# Altium schematic sheet POE.SchDoc
size A4; SheetNumber: 8; SheetTotal: 14
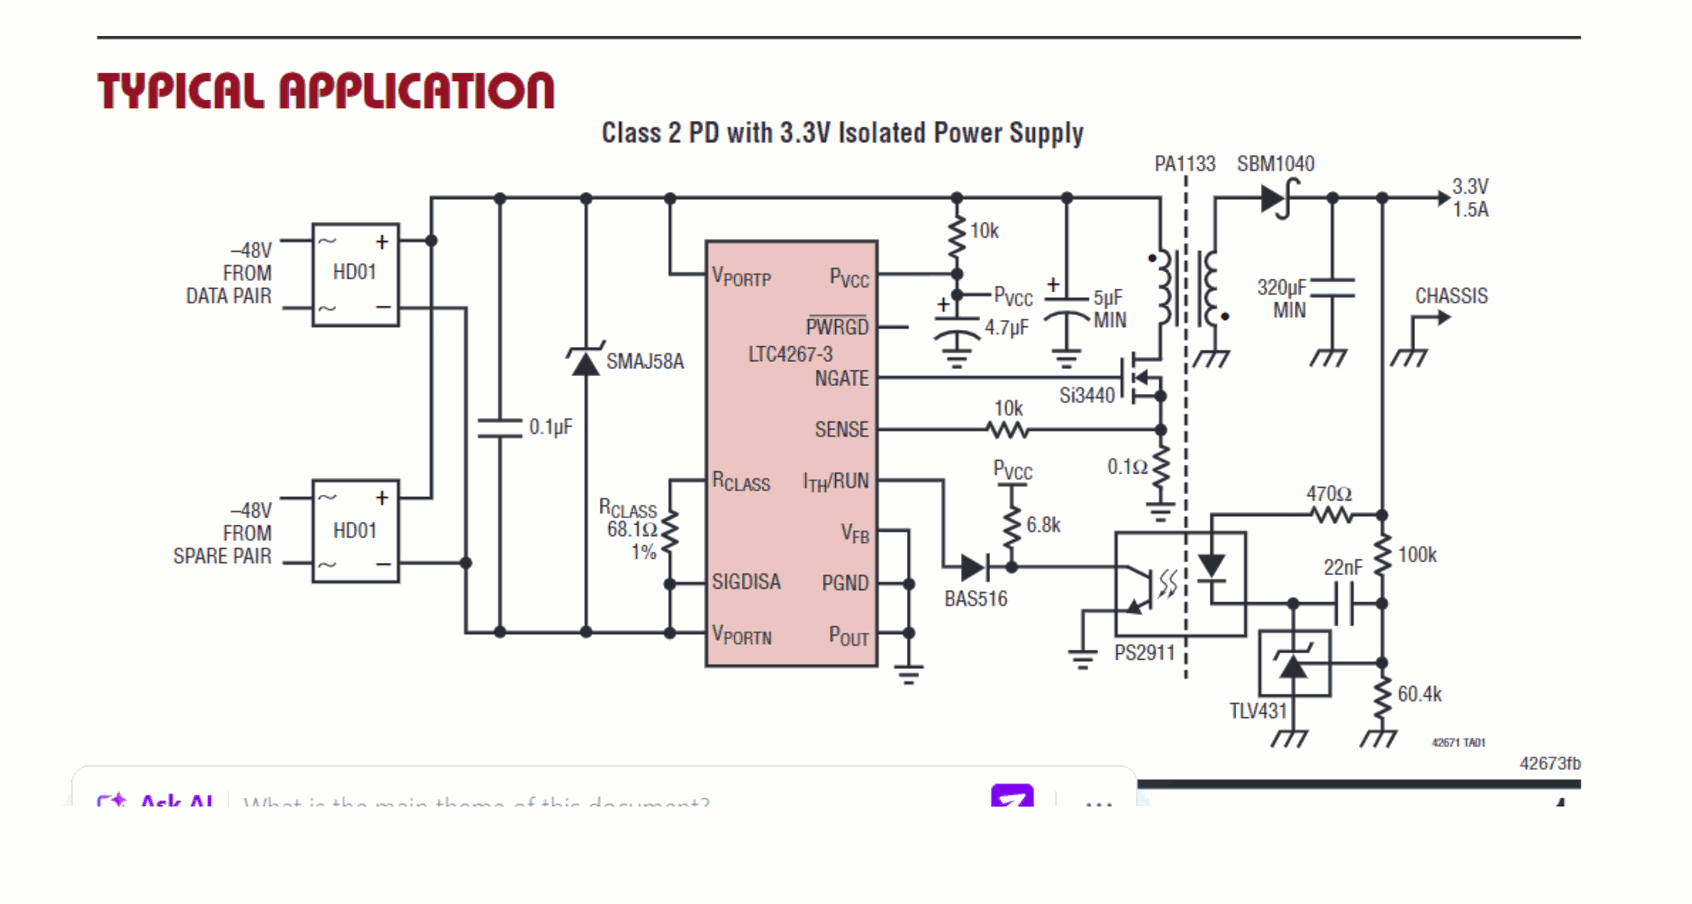
[diagram p0: POE.SchDoc, top left]
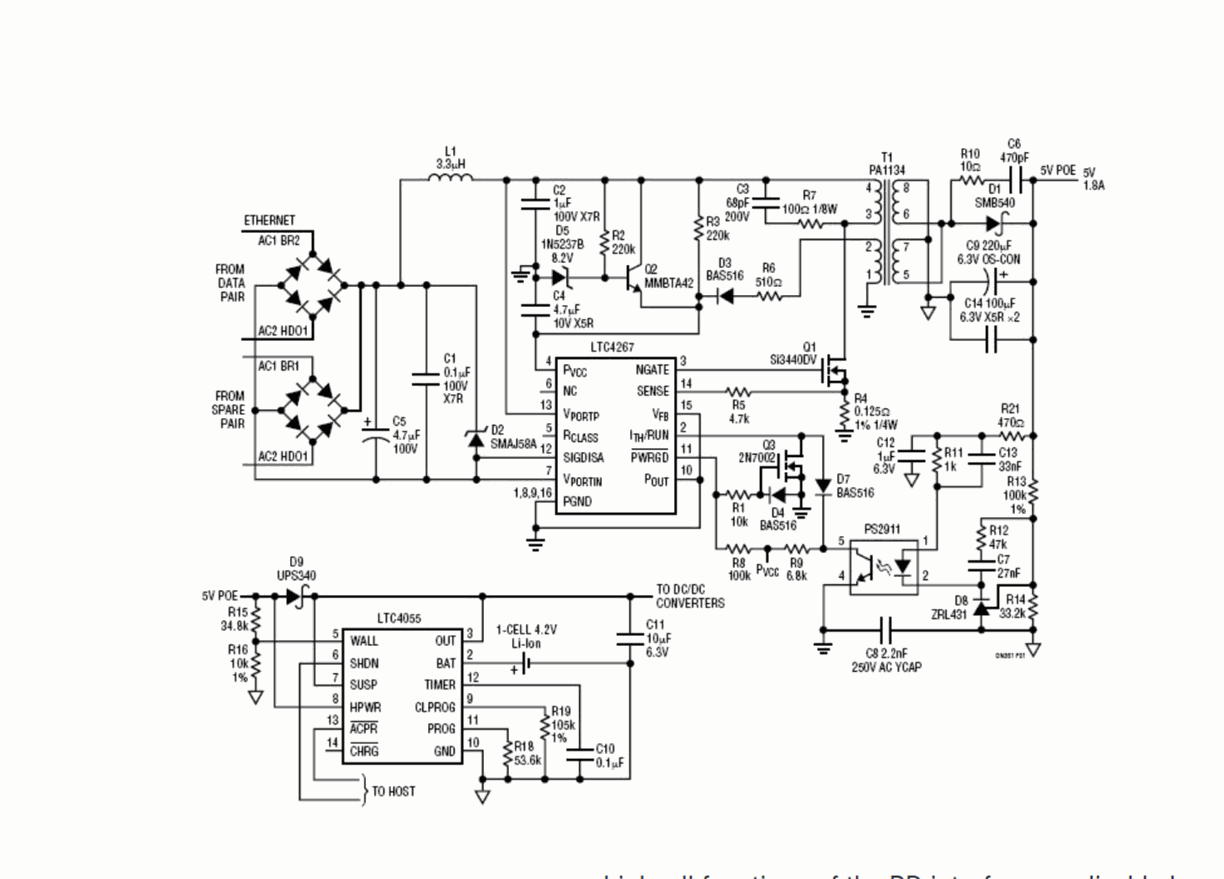
[diagram p1: POE.SchDoc, top right]
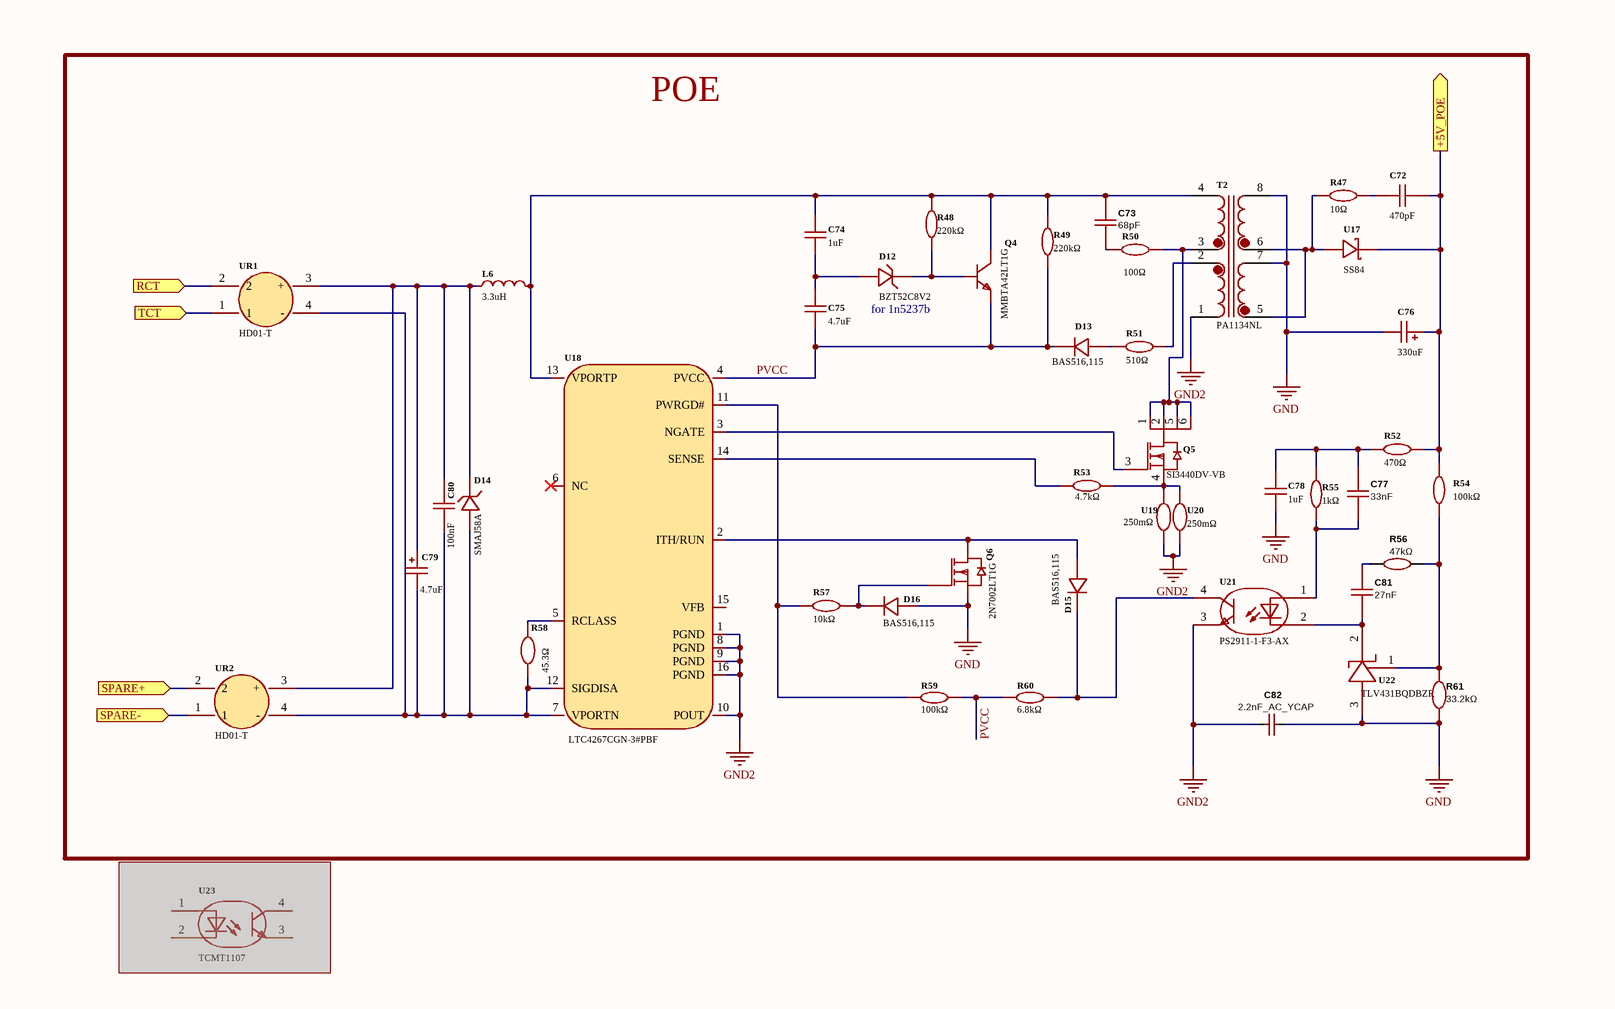
[diagram p2: POE.SchDoc, bottom left]
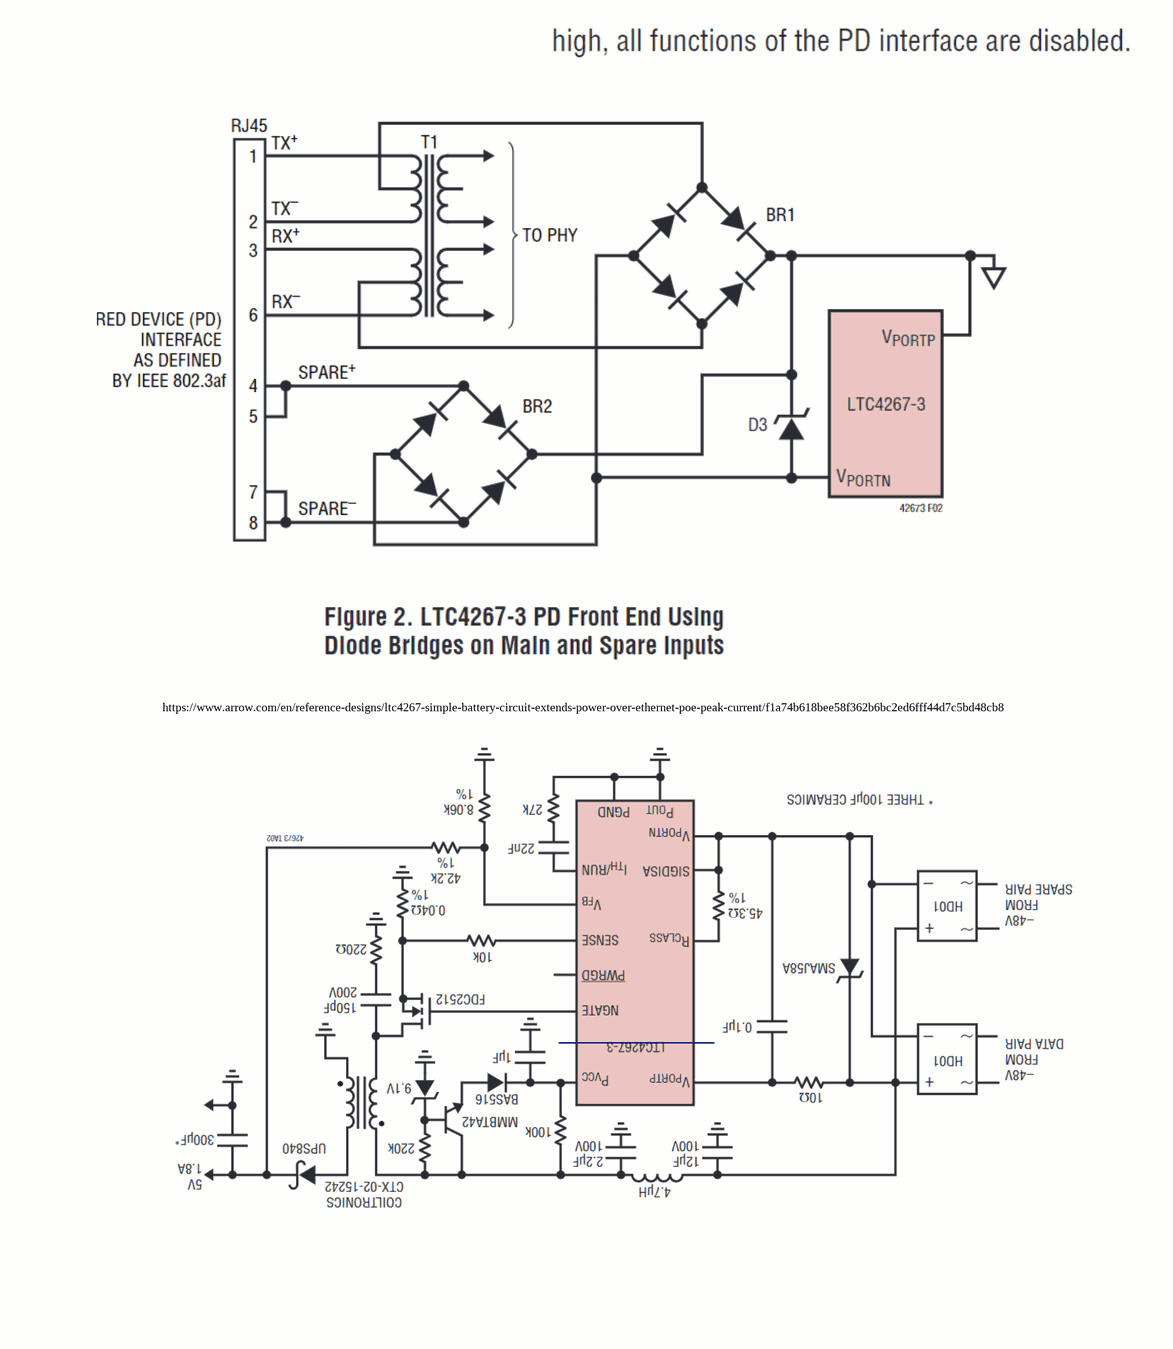
[diagram p3: POE.SchDoc, bottom right]

## Parts
C72  470pF  [C_1206]
C73  68pF  [C_1206]
C74  1uF  [C_0805]
C75  4.7uF  [C_0805]
C76  330uF  [CASE-D_7343]
C77  33nF  [C_0805]
C78  1uF  [C_0805]
C79  4.7uF  [CAP-SMD_L6.0-W3.2-R-RD]
C80  100nF  [C_0603]
C81  27nF  [C_0805]
C82  2.2nF_AC_YCAP  [C_1206]
D12  BZT52C8V2  [SOD-123_L2.8-W1.8-LS3.7-RD]
D13  BAS516,115  [SOD-523F_L1.2-W0.8-LS1.7-RD]
D14  SMAJ58A  [SMA_L4.3-W2.6-LS5.2-RD]
D15  BAS516,115  [SOD-523F_L1.2-W0.8-LS1.7-RD]
D16  BAS516,115  [SOD-523F_L1.2-W0.8-LS1.7-RD]
L6  3.3uH  [IND-SMD_L5.4-W5.2_PSPMAA0503]
Q4  MMBTA42LT1G  [SOT-23-3_L2.9-W1.6-P1.90-LS2.8-BR]
Q5  SI3440DV-VB  [SOT-23-6_L2.9-W1.6-P0.95-LS2.8-BR]
Q6  2N7002LT1G  [SOT-23_L2.9-W1.3-P1.90-LS2.4-BR]
R47  10Ω  [R_1206]
R48  220kΩ  [R_0805]
R49  220kΩ  [R_0805]
R50  100Ω  [R_0805]
R51  510Ω  [R_0805]
R52  470Ω  [R_1206]
R53  4.7kΩ  [R_0805]
R54  100kΩ  [R_0805]
R55  1kΩ  [R_0805]
R56  47kΩ  [R_0805]
R57  10kΩ  [R_0805]
R58  45.3Ω  [R_0805]
R59  100kΩ  [R_0805]
R60  6.8kΩ  [R_0603]
R61  33.2kΩ  [R_0805]
T2  PA1134NL  [XFMR_PA1134NL]
U17  SS84  [SMC_L6.9-W5.9-LS7.9-RD]
U18  LTC4267CGN-3#PBF  [SSOP-16_L4.9-W3.9-P0.64-LS6.0-BL]
U19  250mΩ  [R2512]
U20  250mΩ  [R2512]
U21  PS2911-1-F3-AX  [OPTO-SMD_PS2911-1-F3-AX]
U22  TLV431BQDBZR  [SOT-23-3_L2.9-W1.3-P0.95-LS2.4-BR]
U23  TCMT1107  [SOP-4_L4.4-W2.8-P1.27-LS7.0-TL]  (masked out: inside a compile mask, not in the netlist)
UR1  HD01-T  [MBS_L4.7-W4.0-P2.50-LS7.0-TL]
UR2  HD01-T  [MBS_L4.7-W4.0-P2.50-LS7.0-TL]

## Blocks framed on the sheet
POE: C72-C82 D12-D16 L6 Q4-Q6 R47-R61 T2 U17-U22 UR1 UR2

## Ports
+5V_POE (out), RCT (in), SPARE+ (in), SPARE- (in), TCT (in)

## Nets
GND: C76.2 C78.1 C82.2 D16.2(A) Q6.2(S) R61.1 T2.7 T2.8 U22.3(ANODE)
GND2: C82.1 T2.1 U18.1(PGND) U18.8(PGND) U18.9(PGND) U18.10(POUT) U18.16(PGND) U19.1 U20.1 U21.3(Emitter)
+5V_POE: C72.2 C76.1 R52.2 R54.2 U17.1(K) ; port +5V_POE
PVCC: C75.1 D13.1(C) Q4.2 R49.1 R59.1 R60.2 U18.4(PVCC)
RCT: UR1.2 ; port RCT
SPARE+: UR2.2 ; port SPARE+
SPARE-: UR2.1 ; port SPARE-
TCT: UR1.1 ; port TCT
NetC72_1: C72.1 R47.2
NetC73_1: C73.1 R50.1
NetC73_2: C73.2 C74.2 L6.2 Q4.3 R48.2 R49.2 T2.4 U18.13(VPORTP)
NetC74_1: C74.1 C75.2 D12.2
NetC77_1: C77.1 R55.1 U21.1(Anode)
NetC77_2: C77.2 C78.2 R52.1 R55.2
NetC79_1: C79.1 C80.1 D14.1(C) L6.1 UR1.3(+) UR2.3(+)
NetC79_2: C79.2 C80.2 D14.2(A) R58.1 U18.7(VPORTN) U18.12(SIGDISA) UR1.4(-) UR2.4(-)
NetC81_1: C81.1 U21.2(Cathode) U22.2(CATHODE)
NetC81_2: C81.2 R56.1
NetD12_1: D12.1 Q4.1 R48.1
NetD13_2: D13.2(A) R51.1
NetD15_1: D15.1(C) R60.1 U21.4(Collector)
NetD15_2: D15.2(A) Q6.3(D) U18.2(ITH/RUN)
NetD16_1: D16.1(C) Q6.1(G) R57.2
NetQ5_1: Q5.1(D) Q5.2(D) Q5.5(D) Q5.6(D) R50.2 T2.3
NetQ5_3: Q5.3(G) U18.3(NGATE)
NetQ5_4: Q5.4(S) R53.2 U19.2 U20.2
NetR47_1: R47.1 T2.5 T2.6 U17.2(A)
NetR51_2: R51.2 T2.2
NetR53_1: R53.1 U18.14(SENSE)
NetR54_1: R54.1 R56.2 R61.2 U22.1(REF)
NetR57_1: R57.1 R59.2 U18.11(PWRGD#)
NetR58_2: R58.2 U18.5(RCLASS)

Not connected (* = marked no-connect by the designer): U18 6(NC)* 15(VFB)

## Notes on the sheet
- https://www.arrow.com/en/reference-designs/ltc4267-simple-battery-circuit-extends-power-over-ethernet-poe-peak-current/f1a74b618bee58f362b6bc2ed6fff44d7c5bd48cb8
- for 1n5237b
- Project Name:
- Size:
- Date:
- A4
- Version:
- Time:
- V1.4.0.0
- Sheet:
- Of
- File:

## Library data of the parts
C72 = CC1206JRNPOBBN471: Manufacturer: YAGEO(国巨); Add into BOM: yes; Tolerance: ±5%; Voltage Rating: 500V; Temperature Coefficient: NP0; Symbol: CC1206JRNPOBBN471; Device: CC1206JRNPOBBN471; LCSC Part Name: 470pF ±5% 500V; Supplier Part: C577186; Manufacturer Part: CC1206JRNPOBBN471; Supplier Footprint: 1206; JLCPCB Part Class: Extended Part; Datasheet: https://item.szlcsc.com/datasheet/CC1206JRNPOBBN471/604677.html; Supplier: LCSC; Convert to PCB: yes; Value: 470pF
C73 = 68pF: Manufacturer: YAGEO(国巨); Manufacturer Part: AC1206JRNPO0BN680; nameAlias: Value; Contributor: lcsc; Supplier: LCSC; Supplier Part: C2227849; JLCPCB Part Class: Extended Part; spicePre: C; spiceSymbolName: AC1206JRNPO0BN680
C74 C78 = CL21B105KBFNNNE: Manufacturer: SAMSUNG(三星); Add into BOM: yes; Tolerance: ±10%; Voltage Rating: 50V; Temperature Coefficient: X7R; Symbol: CL21B105KBFNNNE; Device: CL21B105KBFNNNE; Supplier: LCSC; Manufacturer Part: CL21B105KBFNNNE; Value: 1uF; Supplier Part: C28323; JLCPCB Part Class: Basic Part; LCSC Part Name: 1uF ±10% 50V; Supplier Footprint: 0805; Datasheet: https://item.szlcsc.com/datasheet/CL21B105KBFNNNE/29074.html; Convert to PCB: yes
C75 = CL21A475KBQNNNE: Manufacturer: SAMSUNG(三星); Add into BOM: yes; Tolerance: ±10%; Voltage Rating: 50V; Temperature Coefficient: X5R; Symbol: CL21A475KBQNNNE; Device: CL21A475KBQNNNE; LCSC Part Name: 4.7uF ±10% 50V; Supplier Part: C98192; Manufacturer Part: CL21A475KBQNNNE; Supplier Footprint: 0805; JLCPCB Part Class: Extended Part; Datasheet: https://item.szlcsc.com/datasheet/CL21A475KBQNNNE/99401.html; Supplier: LCSC; Convert to PCB: yes; Value: 4.7uF
C76 = TAJD337K010RNJ: Manufacturer: Kyocera AVX; Add into BOM: yes; Tolerance: ±10%; Equivalent Series Resistance(ESR): 900mΩ@100kHz; Symbol: TAJD337K010RNJ; Device: TAJD337K010RNJ; LCSC Part Name: 330uF ±10% 10V; Supplier Part: C7226; Manufacturer Part: TAJD337K010RNJ; Supplier Footprint: CASE-D-7343; JLCPCB Part Class: Extended Part; Datasheet: https://atta.szlcsc.com/upload/public/pdf/source/20160107/1457707750344.pdf; Supplier: LCSC; Convert to PCB: yes; Value: 330uF; Operating Temperature: -55℃~+125℃
C77 = 33nF: Manufacturer: YAGEO(国巨); Manufacturer Part: CC0805JRX7R9BB333; nameAlias: Value; Contributor: LCSC; Supplier: LCSC; Supplier Part: C520043; JLCPCB Part Class: Extended Part; spicePre: C; spiceSymbolName: CC0805JRX7R9BB333
C79 = TAJC475K035RNJ: Manufacturer: Kyocera AVX; Add into BOM: yes; Tolerance: ±10%; Voltage Rating: 35V; Equivalent Series Resistance(ESR): 2.2Ω@100kHz; Symbol: TAJC475K035RNJ; Device: TAJC475K035RNJ; LCSC Part Name: 4.7uF ±10% 35V; Supplier Part: C11378; Manufacturer Part: TAJC475K035RNJ; Supplier Footprint: CASE-C-6032-28(mm); JLCPCB Part Class: Extended Part; Supplier: LCSC; Convert to PCB: yes; Value: 4.7uF; Operating Temperature: -55℃~+125℃
C80 = CC0603KRX7R9BB104: Manufacturer: YAGEO(国巨); Add into BOM: yes; Tolerance: ±10%; Voltage Rating: 50V; Temperature Coefficient: X7R; Symbol: CC0603KRX7R9BB104; Device: CC0603KRX7R9BB104; LCSC Part Name: 100nF ±10% 50V; Supplier Part: C14663; Manufacturer Part: CC0603KRX7R9BB104; Supplier Footprint: 0603; JLCPCB Part Class: Basic Part; Datasheet: https://item.szlcsc.com/datasheet/CC0603KRX7R9BB104/15331.html; Supplier: LCSC; Convert to PCB: yes; Value: 100nF
C81 = 27nF: Manufacturer: YAGEO(国巨); Manufacturer Part: CC0805JRX7R9BB273; nameAlias: Value; Contributor: LCSC; Supplier: LCSC; Supplier Part: C520042; JLCPCB Part Class: Extended Part; spicePre: C; spiceSymbolName: CC0805JRX7R9BB273
C82 = 2.2nF: Manufacturer: FH(风华); Manufacturer Part: 1206B222K251NT; nameAlias: Value; Contributor: LCSC; Supplier: LCSC; Supplier Part: C507085; JLCPCB Part Class: Extended Part; spicePre: C; spiceSymbolName: 1206B222K251NT
D12 = BZT52C8V2_C173432: Manufacturer: MDD(辰达半导体); Add into BOM: yes; Diode Configuration: Independent; Zener Voltage(Nom): 8.2V; Reverse Leakage Current (Ir): 500nA; Zener Voltage(Range): 7.79V~8.61V; Pd - Power Dissipation: 500mW; Impedance(Zzt): 30Ω; Symbol: BZT52C8V2_C173432; Device: BZT52C8V2_C173432; LCSC Part Name: 独立式 耐压:8.2V 电流:0.5uA; Supplier Part: C173432; Manufacturer Part: BZT52C8V2; Supplier Footprint: SOD-123; JLCPCB Part Class: Extended Part; Datasheet: https://item.szlcsc.com/datasheet/BZT52C8V2/184821.html; Supplier: LCSC; Convert to PCB: yes
D13 D15 D16 = BAS516,115: Manufacturer: Nexperia(安世); Add into BOM: yes; Diode Configuration: Independent; Voltage - Forward(Vf@If): 1.25V@150mA; Voltage - DC Reverse(Vr): 100V; Current - Rectified: 250mA; Pd - Power Dissipation: 500mW; Reverse Leakage Current (Ir): 500nA@80V; Reverse Recovery Time (trr): 4ns; Non-Repetitive Peak Forward Surge Current: 4A; Symbol: BAS516,115; Device: BAS516,115; LCSC Part Name: BAS516,115; Supplier Part: C10037; Manufacturer Part: BAS516,115; Supplier Footprint: SOD-523; JLCPCB Part Class: Extended Part; Datasheet: https://item.szlcsc.com/datasheet/BAS516%252C115/10573.html; Supplier: LCSC; Convert to PCB: yes; Operating Junction Temperature Range: -
D14 = SMAJ58A_C151246: Manufacturer: Littelfuse(美国力特); Symbol: SMAJ58A-C151246; Add into BOM: yes; Polarity: Unidirectional; Reverse Stand-Off Voltage (Vrwm): 58V; Clamping Voltage: 93.6V; Peak Pulse Current (Ipp): 4.3A@10/1000us; Peak Pulse Power Dissipation (Ppp): 400W@10/1000us; Voltage - Breakdown: 71.2V; Reverse Leakage Current (Ir): 1uA; level of protection: IEC 61000-4-4；IEC 61000-4-2; Type: TVS; Device: SMAJ58A_C151246; Supplier Part: C151246; Supplier: LCSC; Manufacturer Part: SMAJ58A; JLCPCB Part Class: Extended Part; LCSC Part Name: TVS 58V截止 4.3A峰值脉冲; Supplier Footprint: DO-214AC(SMA); Datasheet: https://item.szlcsc.com/datasheet/SMAJ58A/162586.html; Convert to PCB: yes; Operating Temperature: -65℃~+150℃
L6 = PSPMAA0503-3R3M-ANP: Manufacturer: PROD(谱罗德); Add into BOM: yes; Tolerance: ±20%; Current Rating: 5A; Current - Saturation(Isat): 6A; DC Resistance(DCR): 38mΩ; Symbol: PSPMAA0503-3R3M-ANP; Device: PSPMAA0503-3R3M-ANP; LCSC Part Name: 3.3uH ±20% 6A; Supplier Part: C436534; Manufacturer Part: PSPMAA0503-3R3M-ANP; Supplier Footprint: SMD,5.4x5.2mm; JLCPCB Part Class: Extended Part; Datasheet: https://item.szlcsc.com/datasheet/PSPMAA0503-3R3M-ANP/434313.html; Supplier: LCSC; Convert to PCB: yes; Value: 3.3uH; Ratings: AEC-Q200
Q4 = MMBTA42LT1G: Manufacturer: onsemi(安森美); Add into BOM: yes; type: NPN; Current - Collector(Ic): 500mA; Collector - Emitter Voltage VCEO: 300V; Pd - Power Dissipation: 225mW; DC Current Gain: 25@10mA,10V; Transition frequency(fT): 50MHz; Current - Collector Cutoff: 100nA; Vce Saturation(VCE(sat)): 500mV; Symbol: MMBTA42LT1G; Device: MMBTA42LT1G; LCSC Part Name: NPN 电流:500mA 电压:300V; Supplier Part: C94389; Manufacturer Part: MMBTA42LT1G; Supplier Footprint: SOT-23; JLCPCB Part Class: Extended Part; Datasheet: https://item.szlcsc.com/datasheet/MMBTA42LT1G/95587.html; Supplier: LCSC; Convert to PCB: yes; Operating Temperature: -55℃~+150℃
Q5 = SI3440DV-VB: Manufacturer: VBsemi(微碧半导体); Add into BOM: yes; Type: 1 N-channel; Current - Continuous Drain(Id): 3.2A; Pd - Power Dissipation: 1.3W; Gate Threshold Voltage (Vgs(th)@Id): 2.5V; Gate Charge(Qg): 8.2nC@4.5V; Input Capacitance(Ciss@Vds): 424pF@50V; Reverse Transfer Capacitance (Crss@Vds): 42pF@50V; Symbol: SI3440DV; Device: SI3440DV-VB; LCSC Part Name: 1个N沟道 耐压:100V 电流:3.2A; Supplier Part: C710066; Manufacturer Part: SI3440DV-VB; Supplier Footprint: SOT-23-6; JLCPCB Part Class: Extended Part; Datasheet: https://atta.szlcsc.com/upload/public/pdf/source/20221101/E06AFB8796F00FBE54442A2AA46A0081.pdf; Supplier: LCSC; Convert to PCB: yes; RDS(on): -
Q6 = 2N7002LT1G: Manufacturer: onsemi(安森美); Add into BOM: yes; Type: 1 N-Channel; Drain Source On Resistance (RDS(on)@Vgs,Id): 7.5Ω@10V,500mA; Gate Threshold Voltage (Vgs(th)@Id): 2.5V@250uA; Input Capacitance (Ciss@Vds): 50pF@25V; Reverse Transfer Capacitance (Crss@Vds): 5pF@25V; Symbol: 2N7002LT1G; Device: 2N7002LT1G; LCSC Part Name: 1个N沟道 耐压:60V 电流:115mA; Supplier Part: C16338; Manufacturer Part: 2N7002LT1G; Supplier Footprint: SOT-23; JLCPCB Part Class: Extended Part; Datasheet: https://atta.szlcsc.com/upload/public/pdf/source/20140815/1457707218098.pdf; Supplier: LCSC; Convert to PCB: yes; Operating Temperature: -55℃~+150℃
R47 = RC1206FR-0710RL: Manufacturer: YAGEO(国巨); Add into BOM: yes; Tolerance: ±1%; Power(Watts): 250mW; Temperature Coefficient: ±200ppm/℃; Symbol: RC1206FR-0710RL; Device: RC1206FR-0710RL; LCSC Part Name: 厚膜电阻 10Ω ±1% 250mW; Supplier Part: C108080; Manufacturer Part: RC1206FR-0710RL; Supplier Footprint: 1206; JLCPCB Part Class: Extended Part; Datasheet: https://atta.szlcsc.com/upload/public/pdf/source/20180821/C275644_0D56F95EFF785E7D9A1FEF436B37DA78.pdf; Supplier: LCSC; Convert to PCB: yes; Type: Thick Film Resistors; Value: 10Ω; Operating Temperature Range: -55℃~+155℃
R48 R49 = RC0805JR-07220KL: Manufacturer: YAGEO(国巨); Add into BOM: yes; Tolerance: ±5%; Power(Watts): 125mW; Voltage-Supply(Max): 150V; Temperature Coefficient: ±100ppm/℃; Symbol: RC0805JR-07220KL; Device: RC0805JR-07220KL; LCSC Part Name: 厚膜电阻 220kΩ ±5% 125mW; Supplier Part: C114232; Manufacturer Part: RC0805JR-07220KL; Supplier Footprint: 0805; JLCPCB Part Class: Extended Part; Datasheet: https://atta.szlcsc.com/upload/public/pdf/source/20250610/89E4D743C004A82A45145C7A2CC3A578.pdf; Supplier: LCSC; Convert to PCB: yes; Type: Thick Film Resistor; Value: 220kΩ; Operating Temperature: -55℃~+155℃
R50 = RC0805FR-07100RL: Manufacturer: YAGEO(国巨); Add into BOM: yes; Tolerance: ±1%; Power(Watts): 125mW; Voltage-Supply(Max): 150V; Temperature Coefficient: ±100ppm/℃; Symbol: RC0805FR-07100RL; Device: RC0805FR-07100RL; LCSC Part Name: 厚膜电阻 100Ω ±1% 125mW; Supplier Part: C105577; Manufacturer Part: RC0805FR-07100RL; Supplier Footprint: 0805; JLCPCB Part Class: Extended Part; Datasheet: https://item.szlcsc.com/datasheet/RC0805FR-07100RL/106792.html; Supplier: LCSC; Convert to PCB: yes; Type: Thick Film Resistor; Value: 100Ω; Operating Temperature: -55℃~+155℃
R51 = RC0805FR-07510RL: Manufacturer: YAGEO(国巨); Add into BOM: yes; Tolerance: ±1%; Temperature Coefficient: ±100ppm/℃; Symbol: RC0805FR-07510RL; Device: RC0805FR-07510RL; LCSC Part Name: 厚膜电阻 510Ω ±1% 125mW; Supplier Part: C114563; Manufacturer Part: RC0805FR-07510RL; Supplier Footprint: 0805; JLCPCB Part Class: Extended Part; Datasheet: https://atta.szlcsc.com/upload/public/pdf/source/20180821/C275644_0D56F95EFF785E7D9A1FEF436B37DA78.pdf; Supplier: LCSC; Convert to PCB: yes; Type: Thick Film Resistors; Value: 510Ω; Operating Temperature Range: -55℃~+155℃
R52 = 1206W4F4700T5E: Manufacturer: UNI-ROYAL(厚声); Add into BOM: yes; Tolerance: ±1%; Temperature Coefficient: ±100ppm/℃; Symbol: 1206W4F4700T5E; Device: 1206W4F4700T5E; LCSC Part Name: 470Ω ±1% 250mW 厚膜电阻; Supplier Part: C4502; Manufacturer Part: 1206W4F4700T5E; Supplier Footprint: 1206; JLCPCB Part Class: Extended Part; Datasheet: https://atta.szlcsc.com/upload/public/pdf/source/20200306/C422600_1E6D84923E4A46A82E41ADD87F860B5C.pdf; Supplier: LCSC; Convert to PCB: yes; Type: Thick Film Resistors; Value: 470Ω; Operating Temperature Range: -55℃~+155℃
R53 = RC0805JR-074K7L: Manufacturer: YAGEO(国巨); Add into BOM: yes; Tolerance: ±5%; Power(Watts): 125mW; Voltage-Supply(Max): 150V; Temperature Coefficient: ±100ppm/℃; Symbol: RC0805JR-074K7L; Device: RC0805JR-074K7L; LCSC Part Name: 厚膜电阻 4.7kΩ ±5% 125mW; Supplier Part: C105427; Manufacturer Part: RC0805JR-074K7L; Supplier Footprint: 0805; JLCPCB Part Class: Extended Part; Datasheet: https://item.szlcsc.com/datasheet/RC0805JR-074K7L/106642.html; Supplier: LCSC; Convert to PCB: yes; Type: Thick Film Resistors; Value: 4.7kΩ; Operating Temperature: -55℃~+155℃
R54 R59 = RC0805FR-07100KL: Manufacturer: YAGEO(国巨); Add into BOM: yes; Tolerance: ±1%; Power(Watts): 125mW; Voltage-Supply(Max): 150V; Temperature Coefficient: ±100ppm/℃; Symbol: RC0805FR-07100KL; Device: RC0805FR-07100KL; LCSC Part Name: 厚膜电阻 100kΩ ±1% 125mW; Supplier Part: C96346; Manufacturer Part: RC0805FR-07100KL; Supplier Footprint: 0805; JLCPCB Part Class: Extended Part; Datasheet: https://item.szlcsc.com/datasheet/RC0805FR-07100KL/97550.html; Supplier: LCSC; Convert to PCB: yes; Type: Thick Film Resistor; Value: 100kΩ; Operating Temperature: -55℃~+155℃
R55 = RC0805FR-071KL: Manufacturer: YAGEO(国巨); Add into BOM: yes; Tolerance: ±1%; Temperature Coefficient: ±100ppm/℃; Symbol: RC0805FR-071KL; Device: RC0805FR-071KL; LCSC Part Name: 厚膜电阻 1kΩ ±1% 125mW; Supplier Part: C95781; Manufacturer Part: RC0805FR-071KL; Supplier Footprint: 0805; JLCPCB Part Class: Extended Part; Datasheet: https://atta.szlcsc.com/upload/public/pdf/source/20170708/1499509500945.pdf; Supplier: LCSC; Convert to PCB: yes; Type: Thick Film Resistors; Value: 1kΩ; Operating Temperature Range: -55℃~+155℃
R56 = 47kΩ: Manufacturer: YAGEO(国巨); Manufacturer Part: RC0805FR-0747KL; nameAlias: Value; Supplier: LCSC; Supplier Part: C126351; JLCPCB Part Class: Extended Part; spicePre: R; spiceSymbolName: RC0805FR-0747KL
R57 = RC0805FR-0710KL: Manufacturer: YAGEO(国巨); Add into BOM: yes; Tolerance: ±1%; Power(Watts): 125mW; Voltage-Supply(Max): 150V; Temperature Coefficient: ±100ppm/℃; Symbol: RC0805FR-0710KL; Device: RC0805FR-0710KL; LCSC Part Name: 厚膜电阻 10kΩ ±1% 125mW; Supplier Part: C84376; Manufacturer Part: RC0805FR-0710KL; Supplier Footprint: 0805; JLCPCB Part Class: Extended Part; Datasheet: https://atta.szlcsc.com/upload/public/pdf/source/20250610/89E4D743C004A82A45145C7A2CC3A578.pdf; Supplier: LCSC; Convert to PCB: yes; Type: Thick Film Resistor; Value: 10kΩ; Operating Temperature: -55℃~+155℃
R58 = RT0805BRD0745R3L: Manufacturer: YAGEO(国巨); Add into BOM: yes; Tolerance: ±0.1%; Temperature Coefficient: ±25ppm/℃; Symbol: RT0805BRD0745R3L; Device: RT0805BRD0745R3L; LCSC Part Name: 薄膜电阻 45.3Ω ±0.1% 125mW; Supplier Part: C865507; Manufacturer Part: RT0805BRD0745R3L; Supplier Footprint: 0805; JLCPCB Part Class: Extended Part; Datasheet: https://atta.szlcsc.com/upload/public/pdf/source/20200610/C326738_5639A9F1B6EB6E4AE2197577D3456E7F.pdf; Supplier: LCSC; Convert to PCB: yes; Type: Thin Film Resistor; Value: 45.3Ω; Operating Temperature Range: -55℃~+155℃
R60 = RC0603FR-076K8L: Manufacturer: YAGEO(国巨); Add into BOM: yes; Tolerance: ±1%; Power(Watts): 100mW; Voltage-Supply(Max): 75V; Temperature Coefficient: ±100ppm/℃; Symbol: RC0603FR-076K8L; Device: RC0603FR-076K8L; LCSC Part Name: 厚膜电阻 6.8kΩ ±1% 100mW; Supplier Part: C114632; Manufacturer Part: RC0603FR-076K8L; Supplier Footprint: 0603; JLCPCB Part Class: Extended Part; Datasheet: https://item.szlcsc.com/datasheet/RC0603FR-076K8L/115876.html; Supplier: LCSC; Convert to PCB: yes; Type: Thick Film Resistor; Value: 6.8kΩ; Operating Temperature: -55℃~+155℃
R61 = 33.2kΩ: Manufacturer: YAGEO(国巨); Manufacturer Part: RC0805FR-0733K2L; nameAlias: Value; Contributor: LCSC; Supplier: LCSC; Supplier Part: C273830; JLCPCB Part Class: Extended Part; spicePre: R; spiceSymbolName: RC0805FR-0733K2L
T2 = PA1134NL: 253ÂµH Isolation and Data Interface (Encapsulated) Pulse Transformer 1:0.125:0.208 Surface Mount; SnapEDA_Link: https://www.snapeda.com/parts/PA1134NL/Pulse/view-part/?ref=snap; Package: None; Value: *; MF: Pulse; MP: PA1134NL; Check_prices: https://www.snapeda.com/parts/PA1134NL/Pulse/view-part/?ref=eda
U17 = SS84: Manufacturer: GOODWORK(固得沃克); Add into BOM: yes; Diode Configuration: Independent; Voltage - Forward(Vf@If): 550mV@8A; Voltage - DC Reverse(Vr): 40V; Current - Rectified: 8A; Reverse Leakage Current (Ir): 100uA; Operating Junction Temperature Range: -65℃~+150℃; Non-Repetitive Peak Forward Surge Current: 175A; Symbol: SS84; Device: SS84; LCSC Part Name: 电压:40V 电流:8A; Supplier Part: C2943761; Manufacturer Part: SS84; Supplier Footprint: SMC(DO-214AB); JLCPCB Part Class: Extended Part; Datasheet: https://item.szlcsc.com/datasheet/SS84/3328867.html; Supplier: LCSC; Convert to PCB: yes
U18 = LTC4267CGN-3#PBF: Manufacturer: ADI(亚德诺); Add into BOM: yes; Supply Voltage: 57V; Maximum Power: 12.95W; number of channels: 1; Symbol: LTC4267CGN-3#PBF; Device: LTC4267CGN-3#PBF; LCSC Part Name: LTC4267CGN-3#PBF; Supplier Part: C687885; Manufacturer Part: LTC4267CGN-3#PBF; Supplier Footprint: SSOP-16-150mil; JLCPCB Part Class: Extended Part; Datasheet: https://atta.szlcsc.com/upload/public/pdf/source/20200917/C687879_7E0D40D8D4792BF56EAC4A3F32693668.pdf; Supplier: LCSC; Convert to PCB: yes; Type: Power receiving device (PD); Operating Temperature: 0℃~+70℃
U19 U20 = HoJLR2512-3W-250mR-1%: Manufacturer: Milliohm(毫欧); Add into BOM: yes; Tolerance: ±1%; Mounting Sytle: Surface Mount; Symbol: HOJLR2512-3W-250MR-1%; Device: HoJLR2512-3W-250mR-1%; LCSC Part Name: 250mΩ ±1% 3W; Supplier Part: C2903484; Manufacturer Part: HoJLR2512-3W-250mR-1%; Supplier Footprint: 2512; JLCPCB Part Class: Extended Part; Datasheet: https://atta.szlcsc.com/upload/public/pdf/source/20211009/7525CABAB363C979E942C1DD41F1FEF0.pdf; Supplier: LCSC; Convert to PCB: yes; Type: Current Sensing Resistors; Value: 250mΩ
U21 = PS2911-1-F3-AX_C5334506: Manufacturer: RENESAS(瑞萨)/IDT; Add into BOM: yes; Voltage - Forward(Vf): 1.1V; Output Current: 40mA; Isolation Voltage(Vrms): 2.5kV; Number of Outputs: 1; Rise time: 5us; Fall time: 10us; Symbol: PS2911-1-F3-AX_C5334506; Device: PS2911-1-F3-AX_C5334506; LCSC Part Name: 四引脚超小型扁平引脚封装光电耦合器; Supplier Part: C5334506; Manufacturer Part: PS2911-1-F3-AX; Supplier Footprint: SOP-4; JLCPCB Part Class: Extended Part; Datasheet: https://item.szlcsc.com/datasheet/PS2911-1-F3-AX/6098733.html; Supplier: LCSC; Convert to PCB: yes; Operating Temperature: -55℃~+100℃
U22 = TLV431BQDBZR: Manufacturer: TI(德州仪器); Add into BOM: yes; Output Type: Adjustable; Output Voltage: 1.24V~6V; Output Current: 15mA; Tolerance: ±0.5%; Reference Type: Parallel; Minimum Cathode Current for Regulation: 80uA; Symbol: TLV431BQDBZR; Device: TLV431BQDBZR; LCSC Part Name: TLV431x 低电压可调精密分流稳压器; Supplier Part: C398374; Manufacturer Part: TLV431BQDBZR; Supplier Footprint: SOT-23-3; JLCPCB Part Class: Extended Part; Datasheet: https://www.ti.com/cn/lit/gpn/tlv431b; Supplier: LCSC; Convert to PCB: yes; Voltage - Supply: -; Temperature Coefficient: -; Quiescent Current: -; Operating Temperature: -40℃~+125℃
U23 = TCMT1107: Manufacturer: VISHAY(威世); Add into BOM: yes; Input type: DC; Output Type: Phototransistor; Voltage - Forward(Vf): 1.35V; Output Current: 50mA; Isolation Voltage(Vrms): 3.75kV; Reverse Voltage: 6V; Load Voltage: 70V; Number of Outputs: 1; Vce Saturation(VCE(sat)): 300mV@1mA,10mA; Rise time: 5.5us@2mA,100Ω; Fall time: 7us; Current Transfer Ratio (CTR) Minimum: 80%; Current Transfer Ratio (CTR) Maximum/Saturation Value: 160%; Forward Current(If): 60mA; Symbol: TCMT1107; Device: TCMT1107; Supplier: LCSC; Manufacturer Part: TCMT1107; Supplier Part: C81148; JLCPCB Part Class: Extended Part; LCSC Part Name: DC输入 隔离电压(rms):3750V; Supplier Footprint: SOP-4-1.27mm; Datasheet: https://item.szlcsc.com/datasheet/TCMT1107/82298.html; Convert to PCB: yes; Operating Temperature: -40℃~+100℃
UR1 UR2 = HD01-T: Manufacturer: DIODES(美台); Add into BOM: yes; Voltage - Forward(Vf@If): 1V@400mA; Voltage - DC Reverse(Vr): 100V; Current - Rectified: 800mA; Reverse Leakage Current (Ir): 5uA@100V; Non-Repetitive Peak Forward Surge Current: 30A; Operating Junction Temperature Range: -55℃~+150℃; Symbol: HD01-T; Device: HD01-T; Supplier: LCSC; Manufacturer Part: HD01-T; Supplier Part: C52151; JLCPCB Part Class: Extended Part; LCSC Part Name: 耐压:100V 电流:0.8A; Supplier Footprint: MBS; Datasheet: https://item.szlcsc.com/datasheet/HD01-T/53165.html; Convert to PCB: yes